# Altium schematic sheet SCH_FV1_V1.1.schdoc
size 489 x 348 mm
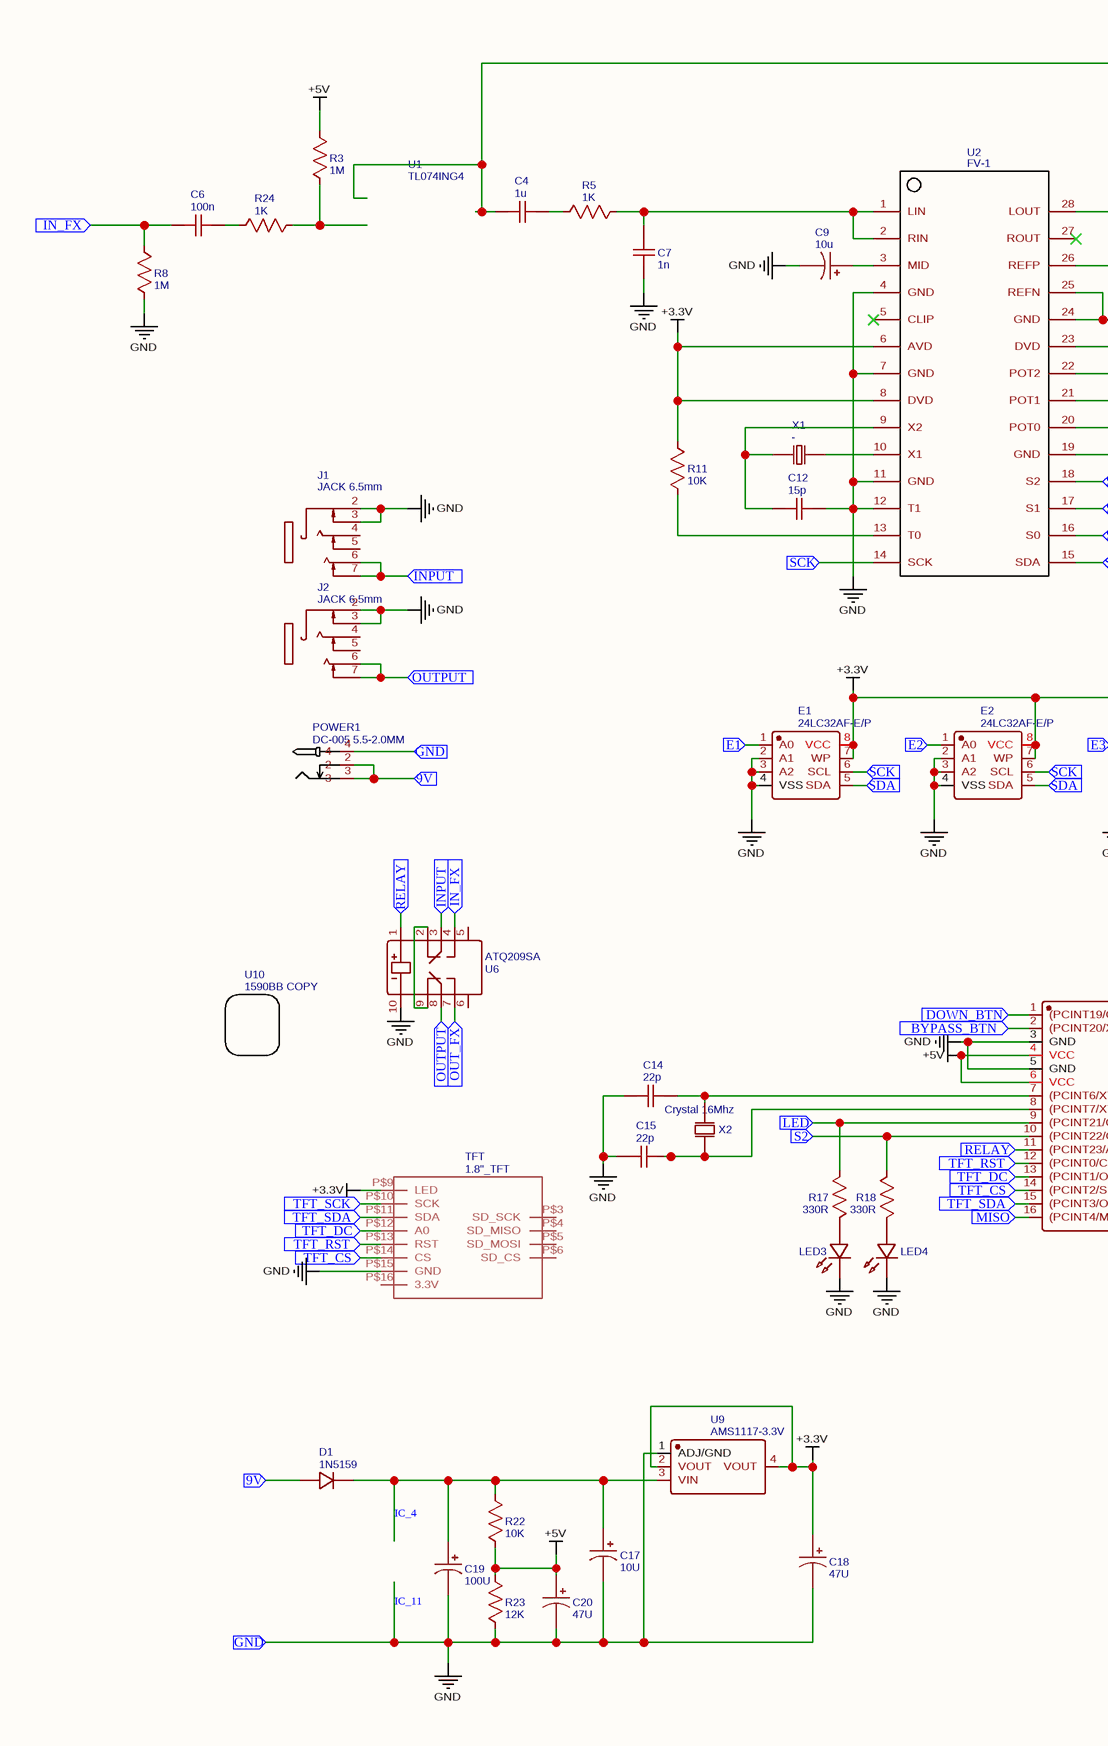
[diagram p0: SCH_FV1_V1.1.schdoc, left]
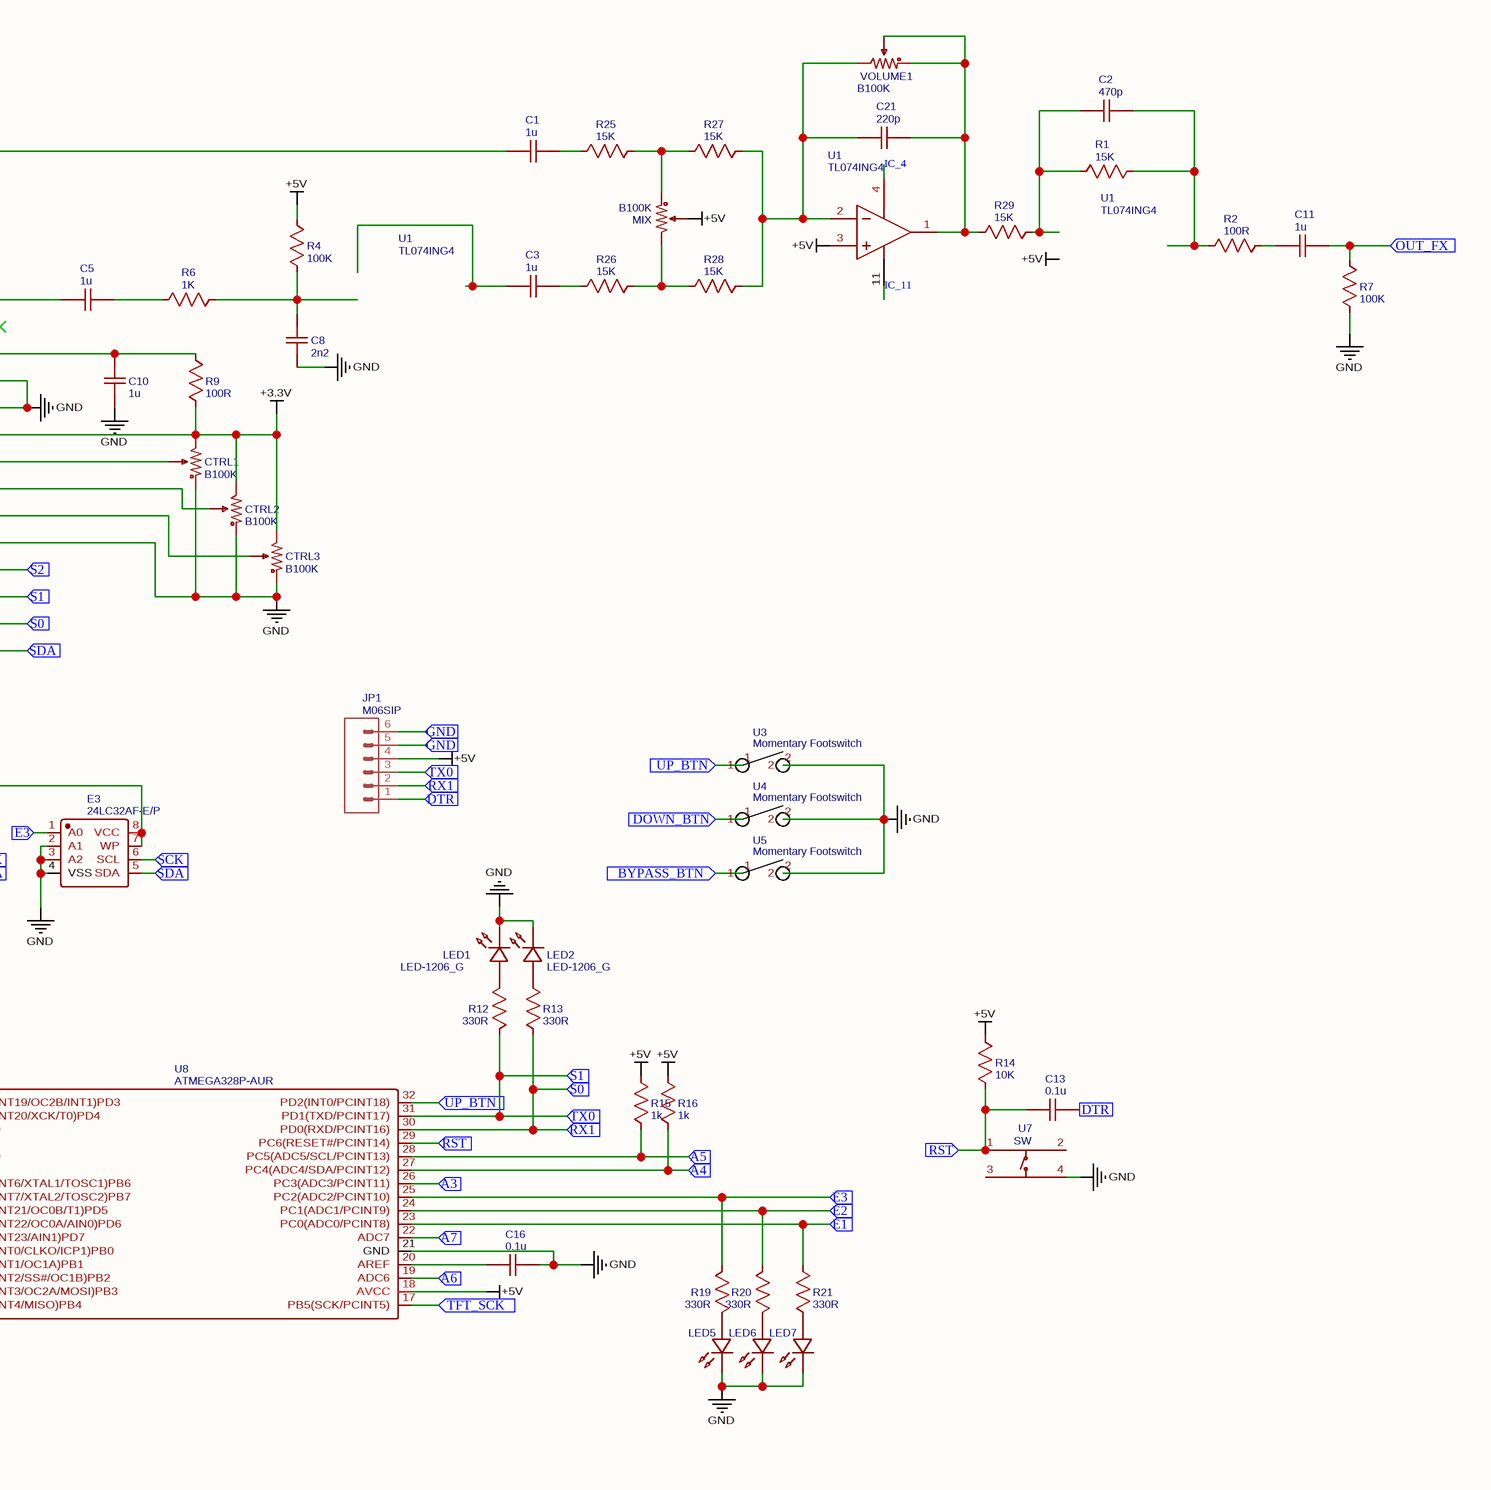
[diagram p1: SCH_FV1_V1.1.schdoc, right]

## Parts
(Parts that share a designator on the sheet are numbered #1, #2 ... from top to bottom, then left to right.)
C1  1u  [MLCC 5MM]
C2  470p  [C1206]
C3  1u  [MLCC 5MM]
C4  1u  [MLCC 5MM]
C5  1u  [MLCC 5MM]
C6  100n  [C1206]
C7  1n  [C1206]
C8  2n2  [C1206]
C9  10u  [CAP_GT_5X11]
C10  1u  [MLCC 5MM]
C11  1u  [MLCC 5MM]
C12  15p  [C1206]
C13  0.1u  [C1206]
C14  22p  [C1206]
C15  22p  [C1206]
C16  0.1u  [C1206]
C17  10U  [CAP_GT_5X11]
C18  47U  [CAP_GT_5X11]
C19  100U  [CAP_GT_5X11]
C20  47U  [CAP_GT_5X11]
C21  220p  [C1206]
CTRL1  B100K  [RES-ADJ-TH_RV09]
CTRL2  B100K  [RES-ADJ-TH_RV09]
CTRL3  B100K  [RES-ADJ-TH_RV09]
D1  1N5159  [DIODE]
E1  24LC32AF-E/P  [PDIP-8_L9.3-W6.4-P2.54-LS7.6-BL]
E2  24LC32AF-E/P  [PDIP-8_L9.3-W6.4-P2.54-LS7.6-BL]
E3  24LC32AF-E/P  [PDIP-8_L9.3-W6.4-P2.54-LS7.6-BL]
J1  JACK 6.5mm  [AUDIO-TH_PJ-609BA]
J2  JACK 6.5mm  [AUDIO-TH_PJ-609BA]
JP1  M06SIP  [1X06]
LED1  LED-1206_G  [LED1206-FD_GREEN]
LED2  LED-1206_G  [LED1206-FD_GREEN]
LED3  LED-1206_G  [LED-DIP-Φ5*2.5MM]  (value not drawn)
LED4  LED-1206_G  [LED1206-FD_GREEN]  (value not drawn)
LED5  LED  [LED1206-FD_GREEN]  (value not drawn)
LED6  LED  [LED1206-FD_GREEN]  (value not drawn)
LED7  LED  [LED1206-FD_GREEN]  (value not drawn)
MIX  B100K  [RES-ADJ-TH_RV09]
POWER1  DC-005 5.5-2.0MM  [DC-IN-TH_DC-5520-1]
R1  15K  [R1206]
R2  100R  [R1206]
R3  1M  [R1206]
R4  100K  [R1206]
R5  1K  [R1206]
R6  1K  [R1206]
R7  100K  [R1206]
R8  1M  [R1206]
R9  100R  [R1206]
R11  10K  [R1206]
R12  330R  [R1206]
R13  330R  [R1206]
R14  10K  [R1206]
R15  1k  [R1206]
R16  1k  [R1206]
R17  330R  [R1206]
R18  330R  [R1206]
R19  330R  [R1206]
R20  330R  [R1206]
R21  330R  [R1206]
R22  10K  [R1206]
R23  12K  [R1206]
R24  1K  [R1206]
R25  15K  [R1206]
R26  15K  [R1206]
R27  15K  [R1206]
R28  15K  [R1206]
R29  15K  [R1206]
TFT  1.8"_TFT  [1.8"_TFT]
U1#1  TL074ING4  [PDIP-14_L19.6-W6.5-P2.54-LS7.9-BL]
U1#2  TL074ING4  [PDIP-14_L19.6-W6.5-P2.54-LS7.9-BL]
U1#3  TL074ING4  [PDIP-14_L19.6-W6.5-P2.54-LS7.9-BL]
U1#4  TL074ING4  [TL074 - TL074A - TL074B]
U2  FV-1  [FV-1]
U3  Momentary Footswitch  [MOMENTARY FOOTSWITCH]
U4  Momentary Footswitch  [MOMENTARY FOOTSWITCH]
U5  Momentary Footswitch  [MOMENTARY FOOTSWITCH]
U6  ATQ209SA  [ATQ209]
U7  SW  [KEY-TH_4P-L6.0-W6.0-P4.50-LS6.50]
U8  ATMEGA328P-AUR  [TQFP-32_L7.0-W7.0-P0.80-LS9.0-BL]
U9  AMS1117-3.3V  [SOT-223-4_L6.5-W3.5-P2.30-LS7.0-BR]
U10  1590BB COPY  [1590BB-EMI]
VOLUME1  B100K  [RES-ADJ-TH_RV09]
X1  -  [OSC-TH_BD3.0-P1.10-D0.4]
X2  Crystal 16Mhz  [GM-CRYSTAL-16MHZ]

## Ports
9V (in), A3 (in), A4 (in), A5 (in), A6 (in), A7 (in), BYPASS_BTN (in), DOWN_BTN (in), DTR (in), E1 (in), E2 (in), E3 (in), GND (in), IN_FX (in), INPUT (in), LED (in), MISO (in), OUT_FX (in), OUTPUT (in), RELAY (in), RST (in), RX1 (in), S0 (in), S1 (in), S2 (in), SCK (in), SDA (in), TFT_CS (in), TFT_DC (in), TFT_RST (in), TFT_SCK (in), TFT_SDA (in), TX0 (in), UP_BTN (in)

## Nets
+3.3V: C18.1 CTRL1.3 CTRL2.3 CTRL3.3 E1.7(WP) E1.8(VCC) E2.7(WP) E2.8(VCC) E3.7(WP) E3.8(VCC) R9.2 R11.1 TFT.P$9(LED) U2.6(AVD) U2.8(DVD) U2.23(DVD) U9.2(VOUT) U9.4(VOUT)
+5V: C20.1 JP1.4 MIX.2 R3.2 R4.2 R14.2 R15.2 R16.2 R22.1 R23.1 U1#1.3(IN1+) U8.4(VCC) U8.6(VCC) U8.18(AVCC)
IC_11: C7.1 C8.1 C9.2 C10.2 C12.2 C14.1 C15.1 C16.2 C17.2 C18.2 C19.2 C20.2 CTRL1.1 CTRL2.1 CTRL3.1 E1.2(A1) E1.3(A2) E1.4(VSS) E2.2(A1) E2.3(A2) E2.4(VSS) E3.2(A1) E3.3(A2) E3.4(VSS) J1.2 J1.3 J2.2 J2.3 JP1.5 JP1.6 LED1.2 LED2.2 LED3.2 LED4.2 LED5.2 LED6.2 LED7.2 POWER1.4 R7.2 R8.1 R23.2 TFT.P$15(GND) U1#1.11(VCC-) U2.4(GND) U2.7(GND) U2.11(GND) U2.12(T1) U2.19(GND) U2.24(GND) U2.25(REFN) U3.2 U4.2 U5.2 U6.10 U7.4 U8.3(GND) U8.5(GND) U8.21(GND) U9.1(ADJ/GND) ; port GND  [also labelled GND]
9V: D1.2 POWER1.2 POWER1.3 ; port 9V
A3: U8.26(PC3(ADC3/PCINT11)) ; port A3
A4: R16.1 U8.27(PC4(ADC4/SDA/PCINT12)) ; port A4
A5: R15.1 U8.28(PC5(ADC5/SCL/PCINT13)) ; port A5
A6: U8.19(ADC6) ; port A6
A7: U8.22(ADC7) ; port A7
BYPASS_BTN: U5.1 U8.2((PCINT20/XCK/T0)PD4) ; port BYPASS_BTN
DOWN_BTN: U4.1 U8.1((PCINT19/OC2B/INT1)PD3) ; port DOWN_BTN
DTR: C13.2 JP1.1 ; port DTR
E1: E1.1(A0) R21.2 U8.23(PC0(ADC0/PCINT8)) ; port E1
E2: E2.1(A0) R20.2 U8.24(PC1(ADC1/PCINT9)) ; port E2
E3: E3.1(A0) R19.2 U8.25(PC2(ADC2/PCINT10)) ; port E3
IC_4: C17.1 C19.1 D1.1 R22.2 U1#1.4(VCC+) U9.3(VIN)
IN_FX: C6.1 R8.2 U6.4 ; port IN_FX
INPUT: J1.6 J1.7 U6.3 ; port INPUT
LED: R17.2 U8.9((PCINT21/OC0B/T1)PD5) ; port LED
MISO: U8.16((PCINT4/MISO)PB4) ; port MISO
OUT_FX: C11.2 R7.1 U6.7 ; port OUT_FX
OUTPUT: J2.6 J2.7 U6.8 ; port OUTPUT
RELAY: U6.1 U8.11((PCINT23/AIN1)PD7) ; port RELAY
RST: C13.1 R14.1 U7.1 U8.29(PC6(RESET#/PCINT14)) ; port RST
RX1: JP1.2 R13.1 U2.16(S0) U8.30(PD0(RXD/PCINT16)) ; port S0, port RX1
S1: JP1.3 R12.1 U2.17(S1) U8.31(PD1(TXD/PCINT17)) ; port S1, port TX0
S2: R18.2 U2.18(S2) U8.10((PCINT22/OC0A/AIN0)PD6) ; port S2
SCK: E1.6(SCL) E2.6(SCL) E3.6(SCL) U2.14(SCK) ; port SCK
SDA: E1.5(SDA) E2.5(SDA) E3.5(SDA) U2.15(SDA) ; port SDA
TFT_CS: TFT.P$14(CS) U8.14((PCINT2/SS#/OC1B)PB2) ; port TFT_CS
TFT_DC: TFT.P$12(A0) U8.13((PCINT1/OC1A)PB1) ; port TFT_DC
TFT_RST: TFT.P$13(RST) U8.12((PCINT0/CLKO/ICP1)PB0) ; port TFT_RST
TFT_SCK: TFT.P$10(SCK) U8.17(PB5(SCK/PCINT5)) ; port TFT_SCK
TFT_SDA: TFT.P$11(SDA) U8.15((PCINT3/OC2A/MOSI)PB3) ; port TFT_SDA
UP_BTN: U3.1 U8.32(PD2(INT0/PCINT18)) ; port UP_BTN
NetC1_1: C1.1 C4.1
NetC1_2: C1.2 R25.2
NetC2_1: C2.1 R1.2 R29.1
NetC2_2: C2.2 R1.1 R2.2
NetC3_2: C3.2 R26.2
NetC4_2: C4.2 R5.2
NetC5_1: C5.1 U2.28(LOUT)
NetC5_2: C5.2 R6.1
NetC6_2: C6.2 R24.2
NetC7_2: C7.2 R5.1 U2.1(LIN) U2.2(RIN)
NetC8_2: C8.2 R4.1 R6.2
NetC9_1: C9.1 U2.3(MID)
NetC10_1: C10.1 R9.1 U2.26(REFP)
NetC11_1: C11.1 R2.1
NetC12_1: C12.1 U2.9(X2) X1.2
NetC14_2: C14.2 U8.7((PCINT6/XTAL1/TOSC1)PB6) X2.1
NetC15_2: C15.2 U8.8((PCINT7/XTAL2/TOSC2)PB7) X2.2
NetC16_1: C16.1 U8.20(AREF)
NetC21_1: C21.1 R27.1 R28.1 U1#1.2(IN1-) VOLUME1.3
NetC21_2: C21.2 R29.2 U1#1.1(OUT1) VOLUME1.1 VOLUME1.2
NetCTRL1_2: CTRL1.2 U2.22(POT2)
NetCTRL2_2: CTRL2.2 U2.21(POT1)
NetCTRL3_2: CTRL3.2 U2.20(POT0)
NetLED1_1: LED1.1 R12.2
NetLED2_1: LED2.1 R13.2
NetLED3_1: LED3.1 R17.1
NetLED4_1: LED4.1 R18.1
NetLED5_1: LED5.1 R19.1
NetLED6_1: LED6.1 R20.1
NetLED7_1: LED7.1 R21.1
NetMIX_1: MIX.1 R25.1 R27.2
NetMIX_3: MIX.3 R26.1 R28.2
NetR3_1: R3.1 R24.1
NetR11_2: R11.2 U2.13(T0)
NetU2_10: U2.10(X1) X1.1
NetU6_2: U6.2 U6.9

Not connected (* = marked no-connect by the designer): C3 1; J1 4 5; J2 4 5; TFT P$3(SD_SCK) P$4(SD_MISO) P$5(SD_MOSI) P$6(SD_CS) P$16(3.3V); U2 5(CLIP)* 27(ROUT)*; U6 5 6; U7 2 3

## Notes on the sheet
- Labels drawn without touching a wire or pin: +5V

## Library data of the parts
C1 C3-C5 C10 C11 = 1u: nameAlias: Value(F); Contributor: LCEDA_Lib; spicePre: C; spiceSymbolName: C_0603_US
C2 = 470p: nameAlias: Value(F); Contributor: LCEDA_Lib; spicePre: C; spiceSymbolName: C_0603_US
C6 = 100n: nameAlias: Value(F); Contributor: LCEDA_Lib; spicePre: C; spiceSymbolName: C_0603_US
C7 = 1n: nameAlias: Value(F); Contributor: LCEDA_Lib; spicePre: C; spiceSymbolName: C_0603_US
C8 = 2n2: nameAlias: Value(F); Contributor: LCEDA_Lib; spicePre: C; spiceSymbolName: C_0603_US
C9 = 10u: nameAlias: Value(F); Contributor: LCEDA_Lib; spicePre: C; spiceSymbolName: CE_TH_D3.0×F1.5_US
C12 = 15p: nameAlias: Value(F); Contributor: LCEDA_Lib; spicePre: C; spiceSymbolName: C_0603_US
C13 C16 = 0.1u: nameAlias: Value(F); Contributor: LCEDA_Lib; spicePre: C; spiceSymbolName: C_1206_US
C14 C15 = 22p: nameAlias: Value(F); Contributor: LCEDA_Lib; spicePre: C; spiceSymbolName: C_1206_US
C17 = 10U: nameAlias: Value(F); Contributor: LCEDA_Lib; spicePre: C; spiceSymbolName: CE_TH_D3.0×F1.5_US
C18 C20 = 47U: nameAlias: Value(F); Contributor: LCEDA_Lib; spicePre: C; spiceSymbolName: CE_TH_D3.0×F1.5_US
C19 = 100U: nameAlias: Value(F); Contributor: LCEDA_Lib; spicePre: C; spiceSymbolName: CE_TH_D3.0×F1.5_US
C21 = 220p: nameAlias: Value(F); Contributor: LCEDA_Lib; spicePre: C; spiceSymbolName: C_0603_US
CTRL1-CTRL3 MIX VOLUME1 = B100K: nameAlias: Value; Contributor: LCEDA_Lib; value(Ω): 10K; Supplier: LCSC; spicePre: R; spiceSymbolName: R_3386P_US
D1 = 1N5159: Manufacturer: BLUE ROCKET; Manufacturer Part: 1N4007W; Contributor: LCEDA_Lib; Supplier: LCSC; Supplier Part: C328592; spicePre: D; spiceSymbolName: 1N4007W
E1-E3 = 24LC32AF-E/P: Manufacturer: MICROCHIP(美国微芯); Contributor: lcsc; Supplier: LCSC; Supplier Part: C1350954; Manufacturer Part: 24LC32AF-E/P; JLCPCB Part Class: Extended Part; spicePre: U; spiceSymbolName: 24LC32AF-E/P
J1 J2 = JACK 6.5mm: Manufacturer: HOOYA(皓宇电子); Manufacturer Part: PJ-609BA; Contributor: minhnhathust2002; Supplier: LCSC; Supplier Part: C309277; JLCPCB Part Class: Extended Part; spicePre: J; spiceSymbolName: JACK 6.5mm
JP1 = M06SIP: Contributor: Maryam Magdy; spicePre: J; spiceSymbolName: M06SIP
LED1-LED4 = LED-1206_G: Manufacturer: 国星光电; Manufacturer Part: NCD0805G1; Contributor: LCEDA_Lib; Supplier Part: C84260; spicePre: L; spiceSymbolName: LED-0805_G
LED5-LED7 = LED: Manufacturer: 国星光电; Manufacturer Part: NCD0805G1; Contributor: LCEDA_Lib; Supplier Part: C84260; spicePre: L; spiceSymbolName: LED-0805_G
POWER1 = DC-005 5.5-2.0MM: Manufacturer: BOOMELE; Supplier: LCSC; Manufacturer Part: DC-005 5.5-2.0MM; Supplier Part: C16214; JLCPCB Part Class: Extended Part; spicePre: D; spiceSymbolName: DC-005 5.5-2.0MM
R1 R25-R29 = 15K: nameAlias: Value(Ω); Contributor: LCEDA_Lib; Package Display: No; spicePre: R; spiceSymbolName: R_0603_US
R2 R9 = 100R: nameAlias: Value(Ω); Contributor: LCEDA_Lib; Package Display: No; spicePre: R; spiceSymbolName: R_0603_US
R3 R8 = 1M: nameAlias: Value(Ω); Contributor: LCEDA_Lib; Package Display: No; spicePre: R; spiceSymbolName: R_0603_US
R4 R7 = 100K: nameAlias: Value(Ω); Contributor: LCEDA_Lib; Package Display: No; spicePre: R; spiceSymbolName: R_0603_US
R5 R6 R24 = 1K: nameAlias: Value(Ω); Contributor: LCEDA_Lib; Package Display: No; spicePre: R; spiceSymbolName: R_0603_US
R11 R22 = 10K: nameAlias: Value(Ω); Contributor: LCEDA_Lib; Package Display: No; spicePre: R; spiceSymbolName: R_0603_US
R12 R13 R17-R21 = 330R: nameAlias: Value(Ω); Contributor: LCEDA_Lib; spicePre: R; spiceSymbolName: R_1206_US
R14 = 10K: nameAlias: Value(Ω); Contributor: LCEDA_Lib; spicePre: R; spiceSymbolName: R_1206_US
R15 R16 = 1k: nameAlias: Value(Ω); Contributor: LCEDA_Lib; spicePre: R; spiceSymbolName: R_1206_US
R23 = 12K: nameAlias: Value(Ω); Contributor: LCEDA_Lib; Package Display: No; spicePre: R; spiceSymbolName: R_0603_US
TFT = 1.8"_TFT: Contributor: minhnhathust2002; spicePre: ?; spiceSymbolName: 1.8"_TFT
U1#1-U1#4 = TL074ING4: subpart_no: 1; Manufacturer: TI(德州仪器); Supplier: LCSC; Supplier Part: C1347989; Manufacturer Part: TL074ING4; JLCPCB Part Class: Extended Part; spicePre: U; spiceSymbolName: TL074ING4
U2 = FV-1: Contributor: khoinguyen.ktmt; spicePre: U; spiceSymbolName: FV-1
U3-U5 = Momentary Footswitch: Contributor: Raphael Pelissier; spicePre: U; spiceSymbolName: Momentary Footswitch
U6 = ATQ209SA: Manufacturer: PANASONIC(松下); Contributor: lcsc; Supplier: LCSC; Supplier Part: C2894781; Manufacturer Part: ATQ209SA; spicePre: U; spiceSymbolName: ATQ209SA
U7 = SW: Manufacturer: null; Manufacturer Part: TSWDIP-6*6*6; Contributor: lcsc; Supplier: LCSC; Supplier Part: C9900020134; JLCPCB Part Class: Extended Part; spicePre: U; spiceSymbolName: TSWDIP-6*6*6
U8 = ATMEGA328P-AUR: Manufacturer: MICROCHIP(美国微芯); Contributor: lcsc; Supplier: LCSC; Supplier Part: C618816; Manufacturer Part: ATMEGA328P-AUR; JLCPCB Part Class: Extended Part; spicePre: U; spiceSymbolName: ATMEGA328P-AUR
U9 = AMS1117-3.3V: Manufacturer: WPMtek(维攀); Contributor: LCSC; Supplier: LCSC; Supplier Part: C2688239; Manufacturer Part: AMS1117-3.3V; JLCPCB Part Class: Extended Part; spicePre: U; spiceSymbolName: AMS1117-3.3V
U10 = 1590BB COPY: Contributor: Brian Schmidt; spicePre: U; spiceSymbolName: 1590BB COPY
X1 = -: Manufacturer: KDS(大真空); Manufacturer Part: DT-38 32.768KHz; nameAlias: Value; Supplier: LCSC; Supplier Part: C93228; JLCPCB Part Class: Extended Part; spicePre: X; spiceSymbolName: DT-38 32.768KHz
X2 = Crystal 16Mhz: Contributor: minhnhathust2002; spicePre: X; spiceSymbolName: GM-CRYSTAL-16MHz